# EAGLE schematic drvelocity (EAGLE 7.5.0)
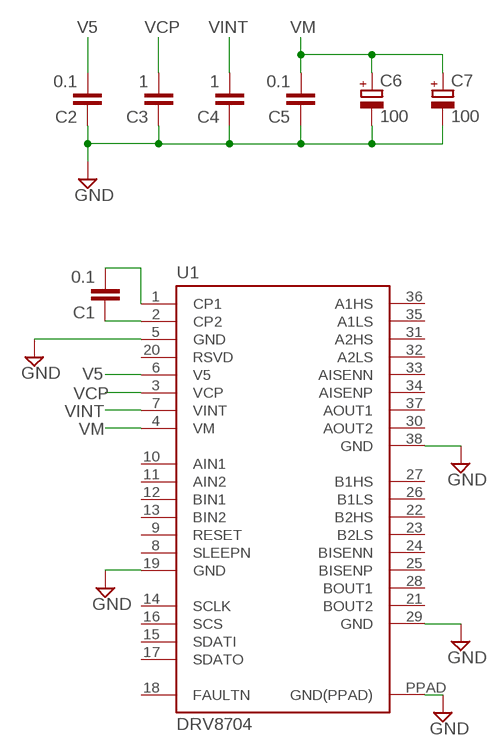
[diagram p0: schematic, sheet 1]

## Parts
C1  0.1  C-EUC0402  [C0402]
C2  0.1  C-EUC0402  [C0402]
C3  1  C-EUC0402  [C0402]
C4  1  C-EUC0402  [C0402]
C5  0.1  C-EUC0402  [C0402]
C6  100  CPOL-EUE3.5-10  [E3,5-10]
C7  100  CPOL-EUE3.5-10  [E3,5-10]
U1  DRV8704  [HTSSOP-38]

## Nets
GND: C2.1 C3.1 C4.1 C5.1 C6.- C7.- U1.5(GND) U1.19(GND) U1.29(GND) U1.38(GND) U1.PPAD(GND(PPAD))
N$1: C1.2 U1.1(CP1)
N$2: C1.1 U1.2(CP2)
V5: C2.2 U1.6(V5)
VCP: C3.2 U1.3(VCP)
VINT: C4.2 U1.7(VINT)
VM: C5.2 C6.+ C7.+ U1.4(VM)
Unconnected: U1.8(SLEEPN) U1.9(RESET) U1.10(AIN1) U1.11(AIN2) U1.12(BIN1) U1.13(BIN2) U1.14(SCLK) U1.15(SDATI) U1.16(SCS) U1.17(SDATO) U1.18(FAULTN) U1.20(RSVD) U1.21(BOUT2) U1.22(B2HS) U1.23(B2LS) U1.24(BISENN) U1.25(BISENP) U1.26(B1LS) U1.27(B1HS) U1.28(BOUT1) U1.30(AOUT2) U1.31(A2HS) U1.32(A2LS) U1.33(AISENN) U1.34(AISENP) U1.35(A1LS) U1.36(A1HS) U1.37(AOUT1)

## Library data of the parts
C1-C5 = resistor:C-EU: CAPACITOR, European symbol
C6 C7 = resistor:CPOL-EU: POLARIZED CAPACITOR, European symbol
U1 = drv8704:DRV8704: DRV8704 Dual H-Bridge PWM Gate Driver